# Altium schematic sheet Voltage Regulation_old.SchDoc: Voltage Regulation
size A4; Date: 01/12/2015; Author: Samuel López; Project: H2H Main Board
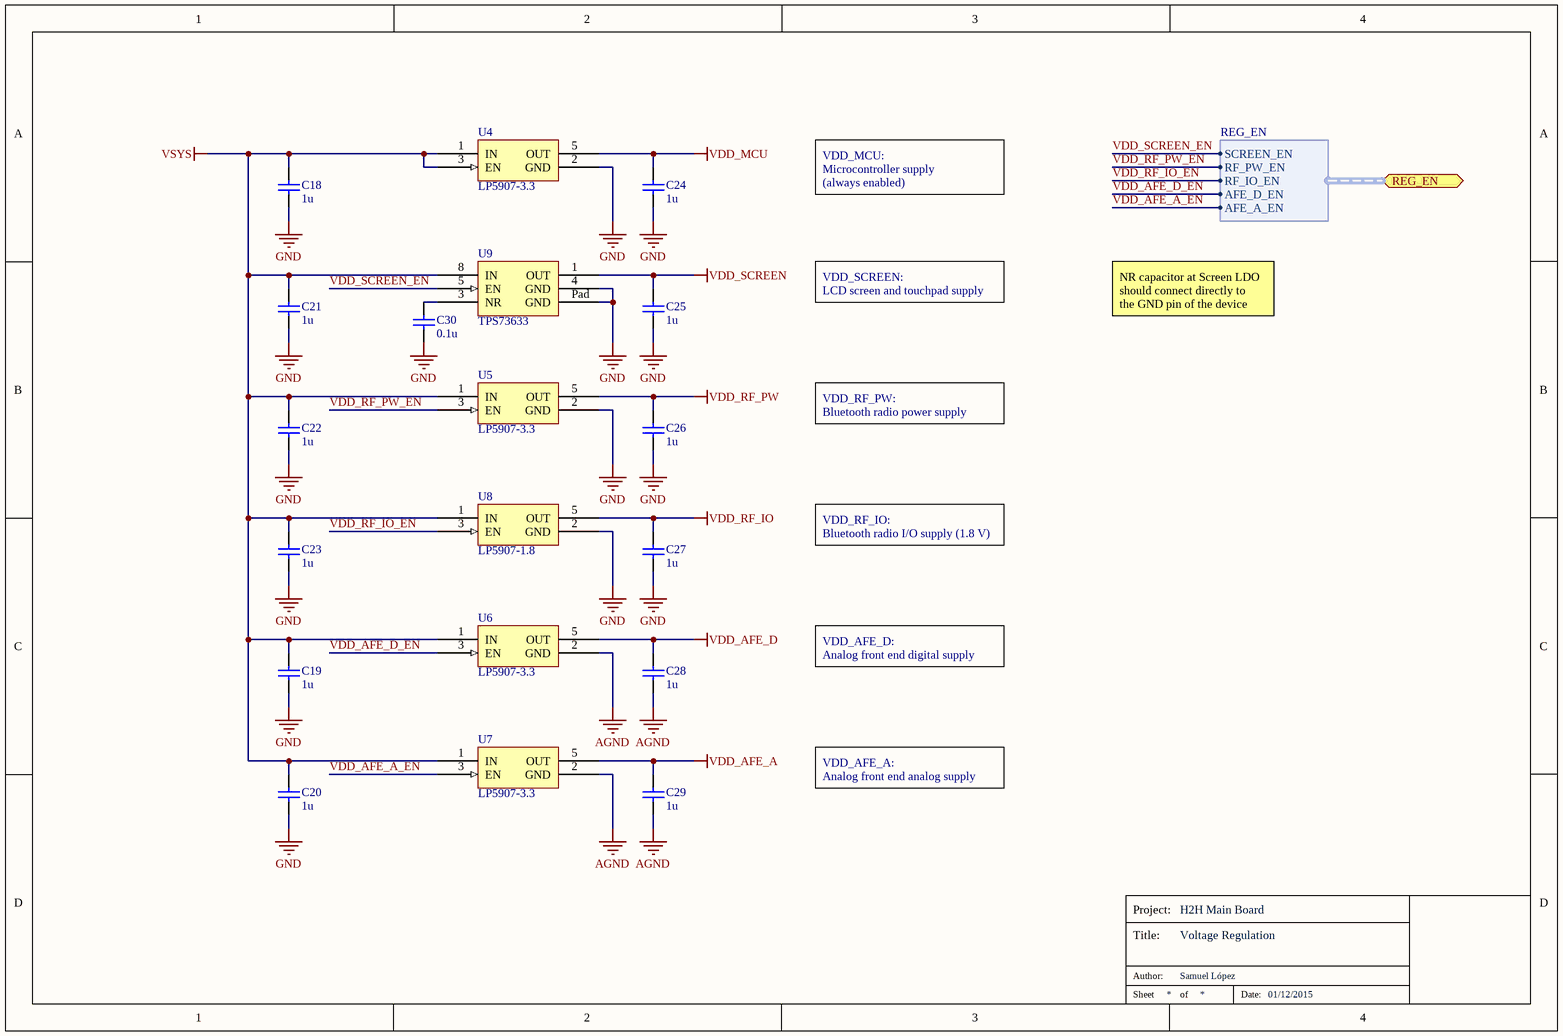
[diagram p0: Voltage Regulation_old.SchDoc]

## Parts
C18  1u  [C0603]
C19  1u  [C0603]
C20  1u  [C0603]
C21  1u  [C0603]
C22  1u  [C0603]
C23  1u  [C0603]
C24  1u  [C0603]
C25  1u  [C0603]
C26  1u  [C0603]
C27  1u  [C0603]
C28  1u  [C0603]
C29  1u  [C0603]
C30  0.1u  [C0603]
U4  LP5907-3.3  [SOT23]
U5  LP5907-3.3  [SOT23]
U6  LP5907-3.3  [SOT23]
U7  LP5907-3.3  [SOT23]
U8  LP5907-1.8  [SOT23]
U9  TPS73633  [PSON65P300X100_HS-9N]

## Ports
REG_EN (harness REG_EN)

## Harnesses
REG_EN: SCREEN_EN, RF_PW_EN, RF_IO_EN, AFE_D_EN, AFE_A_EN

## Nets
AGND: C28.1 C29.1 U6.2(GND) U7.2(GND)
GND: C18.1 C19.1 C20.1 C21.1 C22.1 C23.1 C24.1 C25.1 C26.1 C27.1 C30.1 U4.2(GND) U5.2(GND) U8.2(GND) U9.4(GND) U9.Pad(GND)
VDD_AFE_A: C29.2 U7.5(OUT)
VDD_AFE_D: C28.2 U6.5(OUT)
VDD_MCU: C24.2 U4.5(OUT)
VDD_RF_IO: C27.2 U8.5(OUT)
VDD_RF_PW: C26.2 U5.5(OUT)
VDD_SCREEN: C25.2 U9.1(OUT)
VSYS: C18.2 C19.2 C20.2 C21.2 C22.2 C23.2 U4.1(IN) U4.3(EN) U5.1(IN) U6.1(IN) U7.1(IN) U8.1(IN) U9.8(IN)
VDD_AFE_A_EN: U7.3(EN) ; port REG_EN.AFE_A_EN
VDD_AFE_D_EN: U6.3(EN) ; port REG_EN.AFE_D_EN
VDD_RF_IO_EN: U8.3(EN) ; port REG_EN.RF_IO_EN
VDD_RF_PW_EN: U5.3(EN) ; port REG_EN.RF_PW_EN
VDD_SCREEN_EN: U9.5(EN) ; port REG_EN.SCREEN_EN
NetC30_2: C30.2 U9.3(NR)

## Notes on the sheet
- VDD_MCU:
  Microcontroller supply
  (always enabled)
- VDD_SCREEN:
  LCD screen and touchpad supply
- NR capacitor at Screen LDO
  should connect directly to
  the GND pin of the device
- VDD_RF_PW:
  Bluetooth radio power supply
- VDD_RF_IO:
  Bluetooth radio I/O supply (1.8 V)
- VDD_AFE_D:
  Analog front end digital supply
- VDD_AFE_A:
  Analog front end analog supply
- Project:
- Title:
- Sheet
- Author:
- of
- Date:

## Library data of the parts
C18-C30 = Capacitor: Rated Voltage: *
  C18-C29: Value: 1u
  C30: Value: 0.1u
U4-U7 = LP5907-3.3: Voltage Regulator - Linear; Supplier 1: Digi-Key; Supplier Part Number 1: 296-38557-1-ND
U8 = LP5907-1.8: Voltage Regulator - Linear; Supplier 1: Digi-Key; Supplier Part Number 1: 296-41463-1-ND
U9 = TPS73633: Voltage Regulator - Linear; Supplier 1: Digi-Key; Supplier Part Number 1: 296-17884-1-ND